# Altium schematic sheet Sheet1.SchDoc
size A; SheetNumber: 1; SheetTotal: 2
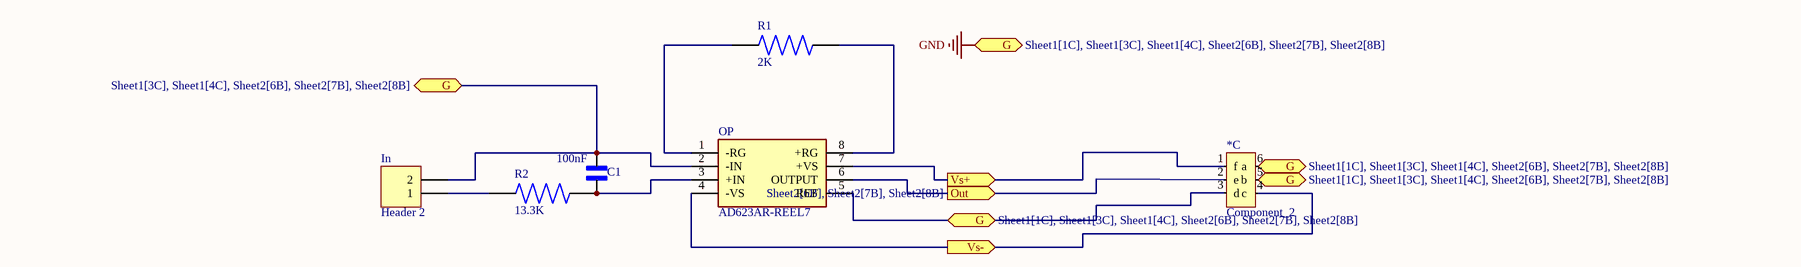
[diagram p0: Sheet1.SchDoc]

## Parts
*C  Component_2  [PCBComponent_1]
C1  100nF  [CAPC1608X90]
In  Header 2  [HDR1X2]
OP  AD623AR-REEL7  [SOIC127P600X175-8N]
R1  2K  [RESC1607X60N]
R2  13.3K  [RESC1607X60N]

## Ports
G (bidir, see Sheet1[1C], Sheet1[3C], Sheet1[4C], Sheet2[6B], Sheet2[7B], Sheet2[8B]), G (bidir, see Sheet1[3C], Sheet1[4C], Sheet2[6B], Sheet2[7B], Sheet2[8B]), Out (out, see Sheet2[6B], Sheet2[7B], Sheet2[8B]), Vs+ (out), Vs- (out)

## Nets
GND: *C.3(d) *C.5(b) *C.6(a) C1.1 In.2 OP.2(-IN) OP.5(REF) ; port G
Out: *C.2(e) OP.6(OUTPUT) ; port Out
Vs+: *C.1(f) OP.7(+VS) ; port Vs+
Vs-: *C.4(c) OP.4(-VS) ; port Vs-
NetC1_2: C1.2 OP.3(+IN) R2.2
NetIn_1: In.1 R2.1
NetOP_1: OP.1(-RG) R1.1
NetOP_8: OP.8(+RG) R1.2

## Library data of the parts
C1 = CC0603KRX7R9BB104: 0.1 ÂµF Â±10% 50V Ceramic Capacitor X7R 0603 (1608 Metric); MF: Yageo; SnapEDA_Link: https://www.snapeda.com/parts/CC0603KRX7R9BB104/Yageo/view-part/?ref=snap; Package: 0603 Yageo; Value: *; MP: CC0603KRX7R9BB104; Check_prices: https://www.snapeda.com/parts/CC0603KRX7R9BB104/Yageo/view-part/?ref=eda
In = Header 2: Header, 2-Pin; LatestRevisionDate: 17-Jul-2002; LatestRevisionNote: Re-released for DXP Platform.; Publisher: Altium Limited
OP = AD623AR-REEL7: Integrated Circuit; Manufacturer_Name: Analog Devices; Datasheet Link: https://componentsearchengine.com/Datasheets/1/AD623AR-REEL7.pdf; Height: 1.75mm; Manufacturer_Part_Number: AD623AR-REEL7; Mouser Part Number: 584-AD623AR-R7; Mouser Price/Stock: http://www.mouser.com/Search/ProductDetail.aspx?qs=NmRFExCfTkEbmJR8gDz96w%3d%3d
R1 R2 = RC0603JR-070RL: Thick film general purpose; Availability: Unavailable; Package: None; MP: RC0603JR-070RL; Value: *; Price: None